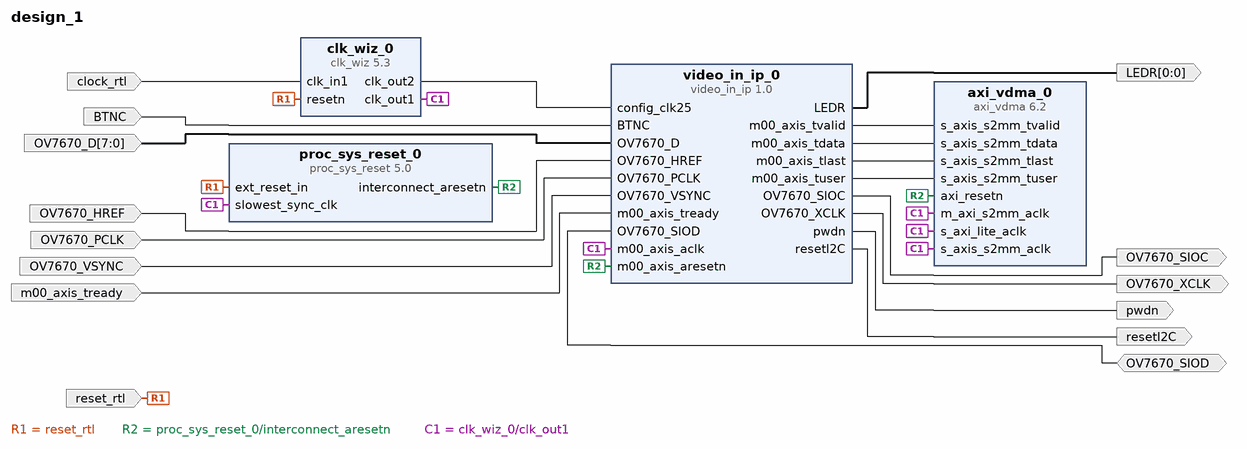
[diagram p0: block diagram of the top level]
# Vivado block design design_1, Vivado 2016.2
create_bd_design design_1

create_bd_port -dir I -type rst reset_rtl
set_property -dict {CONFIG.POLARITY ACTIVE_LOW} [get_bd_ports reset_rtl]
create_bd_port -dir I -type clk clock_rtl
set_property -dict {CONFIG.FREQ_HZ 100000000 CONFIG.PHASE 0.000} [get_bd_ports clock_rtl]
create_bd_port -dir I BTNC
create_bd_port -dir O -from 0 -to 0 LEDR
create_bd_port -dir I -from 7 -to 0 OV7670_D
create_bd_port -dir I OV7670_HREF
create_bd_port -dir I OV7670_PCLK
create_bd_port -dir O OV7670_SIOC
create_bd_port -dir IO OV7670_SIOD
create_bd_port -dir I OV7670_VSYNC
create_bd_port -dir O OV7670_XCLK
create_bd_port -dir O pwdn
create_bd_port -dir O resetI2C
create_bd_port -dir I m00_axis_tready

create_bd_cell -type ip -vlnv xilinx.com:ip:clk_wiz:5.3 clk_wiz_0
set_property -dict [list \
  CONFIG.CLKOUT2_USED true \
  CONFIG.NUM_OUT_CLKS 2 \
  CONFIG.CLKOUT2_REQUESTED_OUT_FREQ 25 \
  CONFIG.RESET_PORT resetn \
  CONFIG.MMCM_DIVCLK_DIVIDE 1 \
  CONFIG.MMCM_CLKOUT1_DIVIDE 40 \
  CONFIG.RESET_TYPE ACTIVE_LOW \
  CONFIG.CLKOUT2_JITTER 175.402 \
  CONFIG.CLKOUT2_PHASE_ERROR 98.575 \
] [get_bd_cells clk_wiz_0]
create_bd_cell -type ip -vlnv xilinx.com:ip:proc_sys_reset:5.0 proc_sys_reset_0
create_bd_cell -type ip -vlnv xilinx.com:ip:axi_vdma:6.2 axi_vdma_0
set_property -dict {CONFIG.c_include_mm2s 0 CONFIG.c_include_s2mm 1} [get_bd_cells axi_vdma_0]
create_bd_cell -type ip -vlnv user:user:video_in_ip:1.0 video_in_ip_0

# ---- connections ----

connect_bd_net [get_bd_ports reset_rtl] [get_bd_pins clk_wiz_0/resetn] [get_bd_pins proc_sys_reset_0/ext_reset_in]
connect_bd_net [get_bd_ports clock_rtl] [get_bd_pins clk_wiz_0/clk_in1]
connect_bd_net [get_bd_pins proc_sys_reset_0/interconnect_aresetn] [get_bd_pins axi_vdma_0/axi_resetn] [get_bd_pins video_in_ip_0/m00_axis_aresetn]
connect_bd_net [get_bd_pins clk_wiz_0/clk_out1] \
  [get_bd_pins proc_sys_reset_0/slowest_sync_clk] [get_bd_pins axi_vdma_0/s_axi_lite_aclk] \
  [get_bd_pins axi_vdma_0/m_axi_s2mm_aclk] [get_bd_pins axi_vdma_0/s_axis_s2mm_aclk] \
  [get_bd_pins video_in_ip_0/m00_axis_aclk]
connect_bd_net [get_bd_pins clk_wiz_0/clk_out2] [get_bd_pins video_in_ip_0/config_clk25]
connect_bd_net [get_bd_ports BTNC] [get_bd_pins video_in_ip_0/BTNC]
connect_bd_net [get_bd_pins video_in_ip_0/LEDR] [get_bd_ports LEDR]
connect_bd_net [get_bd_ports OV7670_D] [get_bd_pins video_in_ip_0/OV7670_D]
connect_bd_net [get_bd_ports OV7670_HREF] [get_bd_pins video_in_ip_0/OV7670_HREF]
connect_bd_net [get_bd_ports OV7670_PCLK] [get_bd_pins video_in_ip_0/OV7670_PCLK]
connect_bd_net [get_bd_pins video_in_ip_0/OV7670_SIOC] [get_bd_ports OV7670_SIOC]
connect_bd_net [get_bd_ports OV7670_SIOD] [get_bd_pins video_in_ip_0/OV7670_SIOD]
connect_bd_net [get_bd_ports OV7670_VSYNC] [get_bd_pins video_in_ip_0/OV7670_VSYNC]
connect_bd_net [get_bd_pins video_in_ip_0/OV7670_XCLK] [get_bd_ports OV7670_XCLK]
connect_bd_net [get_bd_pins video_in_ip_0/pwdn] [get_bd_ports pwdn]
connect_bd_net [get_bd_pins video_in_ip_0/resetI2C] [get_bd_ports resetI2C]
connect_bd_net [get_bd_ports m00_axis_tready] [get_bd_pins video_in_ip_0/m00_axis_tready]
connect_bd_net -net m00_axis_tvalid [get_bd_pins video_in_ip_0/m00_axis_tvalid] [get_bd_pins axi_vdma_0/s_axis_s2mm_tvalid]
connect_bd_net -net m00_axis_tdata [get_bd_pins video_in_ip_0/m00_axis_tdata] [get_bd_pins axi_vdma_0/s_axis_s2mm_tdata]
connect_bd_net -net m00_axis_tlast [get_bd_pins video_in_ip_0/m00_axis_tlast] [get_bd_pins axi_vdma_0/s_axis_s2mm_tlast]
connect_bd_net -net m00_axis_tuser [get_bd_pins video_in_ip_0/m00_axis_tuser] [get_bd_pins axi_vdma_0/s_axis_s2mm_tuser]

validate_bd_design
save_bd_design
